# Altium project Footprint for SR latch.PrjPCB
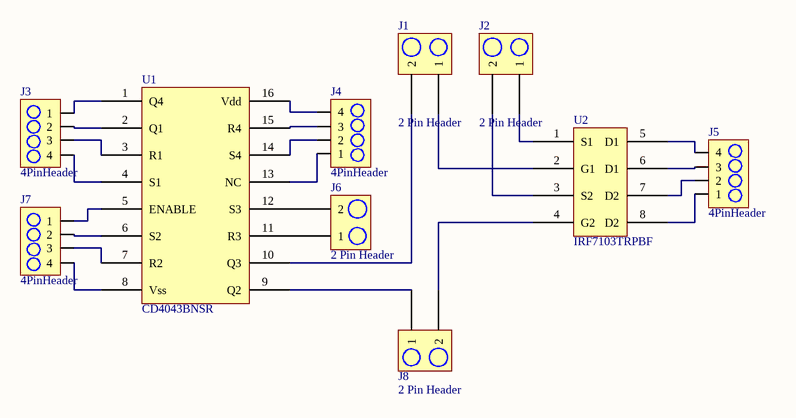
[diagram p0: SR latch Schematic.SchDoc]
1 sheet, 10 parts. Net scope: global (net labels, ports and power ports of the same name join across sheets).

## Sheet SR latch Schematic.SchDoc
size A4

### Parts
J1  2 Pin Header  [2PIN_HEADER]
J2  2 Pin Header  [2PIN_HEADER]
J3  4PinHeader  [4PIN_HEADER]
J4  4PinHeader  [4PIN_HEADER]
J5  4PinHeader  [4PIN_HEADER]
J6  2 Pin Header  [2PIN_HEADER]
J7  4PinHeader  [4PIN_HEADER]
J8  2 Pin Header  [2PIN_HEADER]
U1  CD4043BNSR  [SOIC-16SRLATCH]
U2  IRF7103TRPBF  [SOIC127P600X175-8N]

### Nets
NetJ1_1: J1.1 U2.2(G1)
NetJ1_2: J1.2 U1.10(Q3)
NetJ2_1: J2.1 U2.1(S1)
NetJ2_2: J2.2 U2.3(S2)
NetJ3_1: J3.1 U1.1(Q4)
NetJ3_2: J3.2 U1.2(Q1)
NetJ3_3: J3.3 U1.3(R1)
NetJ3_4: J3.4 U1.4(S1)
NetJ4_1: J4.1 U1.13(NC)
NetJ4_2: J4.2 U1.14(S4)
NetJ4_3: J4.3 U1.15(R4)
NetJ4_4: J4.4 U1.16(Vdd)
NetJ5_1: J5.1 U2.8(D2)
NetJ5_2: J5.2 U2.7(D2)
NetJ5_3: J5.3 U2.6(D1)
NetJ5_4: J5.4 U2.5(D1)
NetJ6_1: J6.1 U1.11(R3)
NetJ6_2: J6.2 U1.12(S3)
NetJ7_1: J7.1 U1.5(ENABLE)
NetJ7_2: J7.2 U1.6(S2)
NetJ7_3: J7.3 U1.7(R2)
NetJ7_4: J7.4 U1.8(Vss)
NetJ8_1: J8.1 U1.9(Q2)
NetJ8_2: J8.2 U2.4(G2)

### Library data of the parts
J1 J2 J6 J8 = 2 Pin Header: 2 pin connector
U1 = CD4043BNSR: IC NOR R/S LATCH 3ST QUAD 16SO; Manufacturer: Texas Instruments; Manufacturer Part Number: CD4043BNSRE4; Number of Elements: 1; Propagation Delay: 300ns; Max Supply Voltage: 18V; Min Supply Voltage: 3V; Polarity: Non-Inverting; Number of Output Lines: 4; Low Level Output Current: 4.2mA; Number of Input Lines: 8; Turn-On Delay Time: 50ns; High Level Output Current: -4.2mA; Logic Function: Latch,NOR; Output Current: 6.8mA; Quiescent Current: 40nA; Supplier 1: Mouser; Stock 1: 0; Pricing 1: 1=0.51, 10=0.419, 50=0.419, 100=0.256, 1000=0.198, 10000=0.157 (USD); Mount: Surface Mount; Case/Package: SOP; Number of Pins: 16; Weight: 0.007079oz; Contact Plating: Gold; Min Operating Temperature: -55°C; Max Operating Temperature: 125°C; Packaging: Tape and Reel; Package Quantity: 2000; Number of Circuits: 1; Number of Bits: 4; Independent Circuits: 4; Radiation Hardening: No; Lead Free: Lead Free; ComponentLink1URL: https://www.verical.com/server-webapp/html/getDatasheet?partID=519121&src-supplier=Verical; ComponentLink1Description: https://www.verical.com/server-webapp/html/getDatasheet?partID=519121&src-supplier=Verical; ComponentLink2URL: http://www.ti.com/lit/ds/symlink/cd4043b.pdf?src-supplier=Digi-Key; ComponentLink2Description: http://www.ti.com/lit/ds/symlink/cd4043b.pdf?src-supplier=Digi-Key; Supplier Part Number 1: 595-CD4043BNSRE4
U2 = IRF7103TRPBF: MOSFET 2N-CH 50V 3A 8-SOIC; Manufacturer: International Rectifier; Rise Time: 8ns; Gate to Source Voltage (Vgs): 20V; Turn-On Delay Time: 9ns; Turn-Off Delay Time: 45ns; Fall Time: 25ns; Nominal Vgs: 3V; Input Capacitance: 290pF; Max Power Dissipation: 2W; Number of Elements: 2; Rds On Max: 130mR; Drain to Source Resistance: 200mR; Element Configuration: Dual; FET Type: 2 N-Channel; Supplier 1: Digi-Key; Manufacturer Part Number: IRF7103TRPBF; Stock 1: 72907; Pricing 1: 1=0.96, 10=0.843, 100=0.6501, 500=0.48154, 1000=0.38523 (USD); Mount: Surface Mount; Case/Package: SOIC; Number of Pins: 8; Min Operating Temperature: -55°C; Max Operating Temperature: 150°C; Continuous Drain Current (ID): 3A; Packaging: Tape and Reel; Package Quantity: 4000; Drain to Source Breakdown Voltage: 50V; Power Dissipation: 2W; Drain to Source Voltage (Vdss): 50V; Threshold Voltage: 3V; Voltage Rating (DC): 50V; Current Rating: 3A; On-State Resistance: 130mR; Length: 5mm; Height: 1.5mm; Width: 4mm; Radiation Hardening: No; REACH SVHC: No SVHC; Lead Free: Lead Free; ComponentLink1URL: http://www.farnell.com/datasheets/34661.pdf?src-supplier=Element14; ComponentLink1Description: http://www.farnell.com/datasheets/34661.pdf?src-supplier=Element14; ComponentLink2URL: http://www.irf.com/product-info/datasheets/data/irf7103.pdf?src-supplier=Avnet; ComponentLink2Description: http://www.irf.com/product-info/datasheets/data/irf7103.pdf?src-supplier=Avnet; ComponentLink3URL: http://www.alliedelec.com/m/d/63081131869883836316976ae6e75666.pdf?src-supplier=Allied+Electronics; ComponentLink3Description: http://www.alliedelec.com/m/d/63081131869883836316976ae6e75666.pdf?src-supplier=Allied+Electronics; ComponentLink4URL: http://www.mouser.com/ds/2/200/irf7103pbf-221493.pdf?src-supplier=Mouser; ComponentLink4Description: http://www.mouser.com/ds/2/200/irf7103pbf-221493.pdf?src-supplier=Mouser; ComponentLink5URL: https://www.verical.com/server-webapp/html/getDatasheet?partID=31726&src-supplier=Verical; ComponentLink5Description: https://www.verical.com/server-webapp/html/getDatasheet?partID=31726&src-supplier=Verical; ComponentLink6URL: http://www.irf.com/product-info/datasheets/data/irf7103pbf.pdf?src-supplier=Future+Electronics; ComponentLink6Description: http://www.irf.com/product-info/datasheets/data/irf7103pbf.pdf?src-supplier=Future+Electronics; ComponentLink7URL: http://www.irf.com/product-info/datasheets/data/irf7103pbf.pdf?src-supplier=Digi-Key; ComponentLink7Description: http://www.irf.com/product-info/datasheets/data/irf7103pbf.pdf?src-supplier=Digi-Key; ComponentLink8URL: https://www.infineon.com/dgdl/irf7103pbf.pdf?fileId=5546d462533600a4015355f0f0141ac6&src-supplier=Digi-Key; ComponentLink8Description: https://www.infineon.com/dgdl/irf7103pbf.pdf?fileId=5546d462533600a4015355f0f0141ac6&src-supplier=Digi-Key; ComponentLink9URL: http://www.irf.com/product-info/datasheets/data/irf7103.pdf?src-supplier=Avnet+Europe; ComponentLink9Description: http://www.irf.com/product-info/datasheets/data/irf7103.pdf?src-supplier=Avnet+Europe; ComponentLink10URL: http://www.irf.com/product-info/datasheets/data/irf7103pbf.pdf?src-supplier=Element14; ComponentLink10Description: http://www.irf.com/product-info/datasheets/data/irf7103pbf.pdf?src-supplier=Element14; Supplier Part Number 1: IRF7103PBFDKR-ND